# Altium schematic sheet FlybackV1.0.SchDoc: 150W-24V-CCM-DCM-FLyback-Converter
size A4; DrawnBy: Arturo B.; Revision: V1.0; SheetNumber: 1; SheetTotal: 1; Project: FlybackV1.0
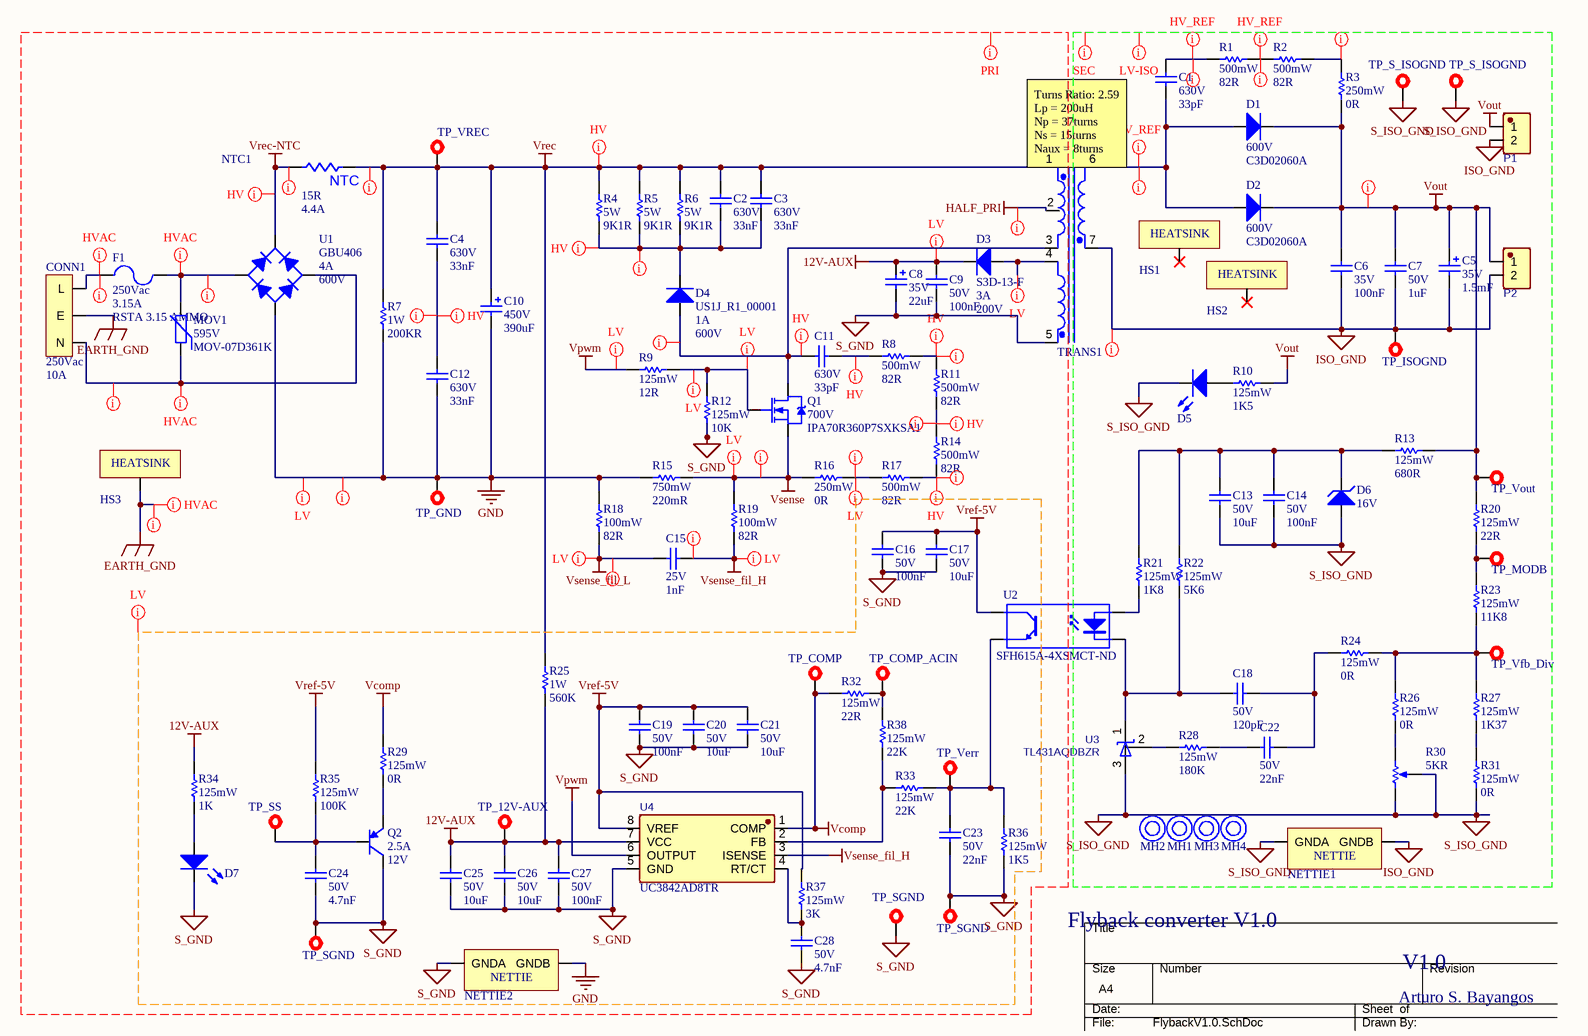
[diagram p0: FlybackV1.0.SchDoc]

## Parts
(Parts that share a designator on the sheet are numbered #1, #2 ... from top to bottom, then left to right.)
C1  value 33pF  Voltage: 630V  [CAP_1206]  (hidden comment: CAP_33P_1206_630V_COG_5%)
C2  value 33nF  Voltage: 630V  [CAP_1206]  (hidden comment: CAP_33N_1206_630V_X7R_10%)
C3  value 33nF  Voltage: 630V  [CAP_1206]  (hidden comment: CAP_33N_1206_630V_X7R_10%)
C4  value 33nF  Voltage: 630V  [CAP_1206]  (hidden comment: CAP_33N_1206_630V_X7R_10%)
C5  value 1.5mF  Voltage_Max: 35V  [CAP_TH_Radial_P5mm_D12.5mm_H16mm]  (hidden comment: CAP_1M5_35V_20%_TH-Radial-P5mm-D12.5mm-H16mm)
C6  value 100nF  Voltage: 35V  [CAP_1206]  (hidden comment: CAP_100N_1206_35V_X7R_10%)
C7  value 1uF  Voltage: 50V  [CAP_0805]  (hidden comment: CAP_1U_0805_50V_X7R_10%)
C8  value 22uF  Voltage_Max: 35V  [CAP_SMD_D5mm-L5.3mm]  (hidden comment: CAP_22U_35V_20%_SMD-D5mm-L5.3mm)
C9  value 100nF  Voltage: 50V  [CAP_0805]  (hidden comment: CAP_100N_0805_50V_X7R_10%)
C10  value 390uF  Voltage_Max: 450V  [CAP_TH_Radial_P10mm_D35mm_H27.5mm]  (hidden comment: CAP_390U_450V_20%_TH-Radial-P10mm-D35mm-H27.5mm)
C11  value 33pF  Voltage: 630V  [CAP_1206]  (hidden comment: CAP_33P_1206_630V_COG_5%)
C12  value 33nF  Voltage: 630V  [CAP_1206]  (hidden comment: CAP_33N_1206_630V_X7R_10%)
C13  value 10uF  Voltage: 50V  [CAP_0805]  (hidden comment: CAP_10U_0805_50V_X5R_10%)
C14  value 100nF  Voltage: 50V  [CAP_0805]  (hidden comment: CAP_100N_0805_50V_X7R_10%)
C15  value 1nF  Voltage: 25V  [CAP_0805]  (hidden comment: CAP_1N_0805_25V_X7R_10%)
C16  value 100nF  Voltage: 50V  [CAP_0805]  (hidden comment: CAP_100N_0805_50V_X7R_10%)
C17  value 10uF  Voltage: 50V  [CAP_0805]  (hidden comment: CAP_10U_0805_50V_X5R_10%)
C18  value 120pF  Voltage: 50V  [CAP_0805]  (hidden comment: CAP_120P_0805_50V_X7R_10%)
C19  value 100nF  Voltage: 50V  [CAP_0805]  (hidden comment: CAP_100N_0805_50V_X7R_10%)
C20  value 10uF  Voltage: 50V  [CAP_0805]  (hidden comment: CAP_10U_0805_50V_X5R_10%)
C21  value 10uF  Voltage: 50V  [CAP_0805]  (hidden comment: CAP_10U_0805_50V_X5R_10%)
C22  value 22nF  Voltage: 50V  [CAP_0805]  (hidden comment: CAP_22N_0805_50V_X7R_10%)
C23  value 22nF  Voltage: 50V  [CAP_0805]  (hidden comment: CAP_22N_0805_50V_X7R_10%)
C24  value 4.7nF  Voltage: 50V  [CAP_0805]  (hidden comment: CAP_4N7_0805_50V_X7R_10%)
C25  value 10uF  Voltage: 50V  [CAP_0805]  (hidden comment: CAP_10U_0805_50V_X5R_10%)
C26  value 10uF  Voltage: 50V  [CAP_0805]  (hidden comment: CAP_10U_0805_50V_X5R_10%)
C27  value 100nF  Voltage: 50V  [CAP_0805]  (hidden comment: CAP_100N_0805_50V_X7R_10%)
C28  value 4.7nF  Voltage: 50V  [CAP_0805]  (hidden comment: CAP_4N7_0805_50V_X7R_10%)
CONN1  Voltage: 250Vac  Current: 10A  [AC_CONNECTOR_703W-00/54]  (hidden comment: AC_CONNECTOR)
D1  Voltage: 600V  Part_Number: C3D02060A  [T0-220-2]  (hidden comment: DIODE_600V_3KPW8_SIC_T0220)
D2  Voltage: 600V  Part_Number: C3D02060A  [T0-220-2]  (hidden comment: DIODE_600V_3KPW8_SIC_T0220)
D3  Part_Number: S3D-13-F  Current: 3A  Voltage: 200V  [DIODE_SMC]  (hidden comment: DIODE_200V_3A_20ns_SMC)
D4  Part_Number: US1J_R1_00001  Current: 1A  Voltage: 600V  [SMA_L4.4-W2.6-LS5.0-RD]  (hidden comment: DIODE_600V_1A_100ns_SMA)
D5  LED_GREEN_0805_25mA  [LED_0805]  (value not drawn)
D6  Voltage: 16V  [ZENER_SOD-323]  (hidden comment: ZENER_16V_SOD323_200mW)
D7  LED_GREEN_0805_25mA  [LED_0805]  (value not drawn)
F1  Voltage AC: 250Vac  Rated Current: 3.15A  Part_Number: RSTA 3.15 AMMO  [FUSE_P5.08mm_W4mm_L8.35mm_H7.8mm]  (hidden comment: FUSE_3.15A_250VAC_64VDC_SlowBlow_BoardMount)
HS1  HEATSINK_TO-220_14.7KPW  [HEATSINK_TO-220_HSS-B20-NPS-02]  (value not drawn)
HS2  HEATSINK_TO-220_14.7KPW  [HEATSINK_TO-220_HSS-B20-NPS-02]  (value not drawn)
HS3  HEATSINK_TO-220_14.7KPW  [HEATSINK_TO-220_HSS-B20-NPS-02]  (value not drawn)
MH1  MOUNTINGHOLE_HDM3_OD3mm  [STANDOFF_HDM3_OD5mm]  (value not drawn)
MH2  MOUNTINGHOLE_HDM3_OD3mm  [STANDOFF_HDM3_OD5mm]  (value not drawn)
MH3  MOUNTINGHOLE_HDM3_OD3mm  [STANDOFF_HDM3_OD5mm]  (value not drawn)
MH4  MOUNTINGHOLE_HDM3_OD3mm  [STANDOFF_HDM3_OD5mm]  (value not drawn)
MOV1  Vclamp @ 10A: 595V  Part_Number: MOV-07D361K  [MOV_P5mm_D9mm_W4.4mm]  (hidden comment: MOV_VC595_VAC230)
NETTIE1  NETTIE  [NETTIE]  (value not drawn)
NETTIE2  NETTIE  [NETTIE]  (value not drawn)
NTC1  R25: 15R  Irated: 4.4A  [NTC_P7.5mm_D16mm]  (hidden comment: NTC_15R_4.4A_D16mm)
P1  SCREWTERMINAL_P5.08mm  [SCREW_TERMINAL_P5.08mm]  (value not drawn)
P2  SCREWTERMINAL_P5.08mm  [SCREW_TERMINAL_P5.08mm]  (value not drawn)
Q1  Vds_Max: 700V  Part_Number: IPA70R360P7SXKSA1  [T0-220-3]  (hidden comment: NMOS_700V_IPA70R360P7SXKSA1)
Q2  Current: 2.5A  VCE: 12V  [SOT-23-3]  (hidden comment: PNP_12V_2.5A_SOT-23-3)
R1  value 82R  Power: 500mW  [RES_1210]  (hidden comment: RES_82R_1210_0.5W_1%)
R2  value 82R  Power: 500mW  [RES_1210]  (hidden comment: RES_82R_1210_0.5W_1%)
R3  value 0R  Power: 250mW  [RES_1210]  (hidden comment: RES_0R_1206_0.25W_1%)
R4  value 9K1R  Power: 5W  [RES_TH_AXIAL_L17.5mm_D6.5mm_Vertical]  (hidden comment: RES_9K1_TH_5W_5%_AXIAL)
R5  value 9K1R  Power: 5W  [RES_TH_AXIAL_L17.5mm_D6.5mm_Vertical]  (hidden comment: RES_9K1_TH_5W_5%_AXIAL)
R6  value 9K1R  Power: 5W  [RES_TH_AXIAL_L17.5mm_D6.5mm_Vertical]  (hidden comment: RES_9K1_TH_5W_5%_AXIAL)
R7  value 200KR  Power: 1W  [RES_TH_AXIAL_L18mm_D6.8mm]  (hidden comment: RES_200K_TH_1W_5%_AXIAL)
R8  value 82R  Power: 500mW  [RES_1210]  (hidden comment: RES_82R_1210_0.5W_1%)
R9  value 12R  Power: 125mW  [RES_0805]  (hidden comment: RES_12R_0805_0.125W_5%)
R10  value 1K5  Power: 125mW  [RES_0805]  (hidden comment: RES_1K5_0805_0.125W_1%)
R11  value 82R  Power: 500mW  [RES_1210]  (hidden comment: RES_82R_1210_0.5W_1%)
R12  value 10K  Power: 125mW  [RES_0805]  (hidden comment: RES_10K_0805_0.125W_1%)
R13  value 680R  Power: 125mW  [RES_0805]  (hidden comment: RES_680R_0805_0.125W_1%)
R14  value 82R  Power: 500mW  [RES_1210]  (hidden comment: RES_82R_1210_0.5W_1%)
R15  value 220mR  Power: 750mW  [RES_1210]  (hidden comment: RES_220mR_1210_0.75W_1%)
R16  value 0R  Power: 250mW  [RES_1210]  (hidden comment: RES_0R_1206_0.25W_1%)
R17  value 82R  Power: 500mW  [RES_1210]  (hidden comment: RES_82R_1210_0.5W_1%)
R18  value 82R  Power: 100mW  [RES_0603]  (hidden comment: RES_82R_0603_0.1W_1%)
R19  value 82R  Power: 100mW  [RES_0603]  (hidden comment: RES_82R_0603_0.1W_1%)
R20  value 22R  Power: 125mW  [RES_0805]  (hidden comment: RES_22R_0805_0.125W_1%)
R21  value 1K8  Power: 125mW  [RES_0805]  (hidden comment: RES_1K8_0805_0.125W_1%)
R22  value 5K6  Power: 125mW  [RES_0805]  (hidden comment: RES_5K6_0805_0.125W_1%)
R23  value 11K8  Power: 125mW  [RES_0805]  (hidden comment: RES_11K8_0805_0.125W_1%)
R24  value 0R  Power: 125mW  [RES_0805]  (hidden comment: RES_0R_0805_0.125W_1%)
R25  value 560K  Power: 1W  [RES_2512]  (hidden comment: RES_560K_2512_1W_1%)
R26  value 0R  Power: 125mW  [RES_0805]  (hidden comment: RES_0R_0805_0.125W_1%)
R27  value 1K37  Power: 125mW  [RES_0805]  (hidden comment: RES_1K37_0805_0.125W_1%)
R28  value 180K  Power: 125mW  [RES_0805]  (hidden comment: RES_180K_0805_0.125W_1%)
R29  value 0R  Power: 125mW  [RES_0805]  (hidden comment: RES_0R_0805_0.125W_1%)
R30  value 5KR  [RES_SMD_POT_3PINS]  (hidden comment: RES_5K_SMD-POT_0.15mW_25%)
R31  value 0R  Power: 125mW  [RES_0805]  (hidden comment: RES_0R_0805_0.125W_1%)
R32  value 22R  Power: 125mW  [RES_0805]  (hidden comment: RES_22R_0805_0.125W_1%)
R33  value 22K  Power: 125mW  [RES_0805]  (hidden comment: RES_22K_0805_0.125W_1%)
R34  value 1K  Power: 125mW  [RES_0805]  (hidden comment: RES_1K_0805_0.125W_1%)
R35  value 100K  Power: 125mW  [RES_0805]  (hidden comment: RES_100K_0805_0.125W_1%)
R36  value 1K5  Power: 125mW  [RES_0805]  (hidden comment: RES_1K5_0805_0.125W_1%)
R37  value 3K  Power: 125mW  [RES_0805]  (hidden comment: RES_3K_0805_0.125W_1%)
R38  value 22K  Power: 125mW  [RES_0805]  (hidden comment: RES_22K_0805_0.125W_1%)
TP_12V-AUX  TESTPOINT_BD2.5mm_MHD1mm  [Test_Point_BD2.5mm_MHD_1mm]  (value not drawn)
TP_COMP  TESTPOINT_BD2.5mm_MHD1mm  [Test_Point_BD2.5mm_MHD_1mm]  (value not drawn)
TP_COMP_ACIN  TESTPOINT_BD2.5mm_MHD1mm  [Test_Point_BD2.5mm_MHD_1mm]  (value not drawn)
TP_GND  TESTPOINT_BD2.5mm_MHD1mm  [Test_Point_BD2.5mm_MHD_1mm]  (value not drawn)
TP_ISOGND  TESTPOINT_BD2.5mm_MHD1mm  [Test_Point_BD2.5mm_MHD_1mm]  (value not drawn)
TP_MODB  TESTPOINT_BD2.5mm_MHD1mm  [Test_Point_BD2.5mm_MHD_1mm]  (value not drawn)
TP_S_ISOGND#1  TESTPOINT_BD2.5mm_MHD1mm  [Test_Point_BD2.5mm_MHD_1mm]  (value not drawn)
TP_S_ISOGND#2  TESTPOINT_BD2.5mm_MHD1mm  [Test_Point_BD2.5mm_MHD_1mm]  (value not drawn)
TP_SGND#1  TESTPOINT_BD2.5mm_MHD1mm  [Test_Point_BD2.5mm_MHD_1mm]  (value not drawn)
TP_SGND#2  TESTPOINT_BD2.5mm_MHD1mm  [Test_Point_BD2.5mm_MHD_1mm]  (value not drawn)
TP_SGND#3  TESTPOINT_BD2.5mm_MHD1mm  [Test_Point_BD2.5mm_MHD_1mm]  (value not drawn)
TP_SS  TESTPOINT_BD2.5mm_MHD1mm  [Test_Point_BD2.5mm_MHD_1mm]  (value not drawn)
TP_Verr  TESTPOINT_BD2.5mm_MHD1mm  [Test_Point_BD2.5mm_MHD_1mm]  (value not drawn)
TP_Vfb_Div  TESTPOINT_BD2.5mm_MHD1mm  [Test_Point_BD2.5mm_MHD_1mm]  (value not drawn)
TP_Vout  TESTPOINT_BD2.5mm_MHD1mm  [Test_Point_BD2.5mm_MHD_1mm]  (value not drawn)
TP_VREC  TESTPOINT_BD2.5mm_MHD1mm  [Test_Point_BD2.5mm_MHD_1mm]  (value not drawn)
TRANS1  Transformer_ETD34_SPLIT  [ETD34_Horizontal_EXTRAPADS]  (value not drawn)
U1  Part_Number: GBU406  I_MAX: 4A  V_Max: 600V  [4_SIP]  (hidden comment: DiodeBrige_600V_4A_TH-4-SIP-5.3mm)
U2  Supplier Part Number 1: SFH615A-4XSMCT-ND  [4-SMD]  (hidden comment: OPTOCOUPLER_SFH615A-4XSMT/R)
U3  TL431AQDBZR  [SOT-23]
U4  UC3842AD8TR  [SOIC-8]

## Nets
12V-AUX: C8.1 C9.2 C25.2 C26.2 C27.2 D3.1(K) R25.2 R34.2 TP_12V-AUX.1(TEST_POINT) U4.7(VCC)
EARTH_GND: CONN1.E HS3.HSMH
GND: C10.2 C12.1 NETTIE2.GNDB R7.1 R15.2 R18.2 TP_GND.1(TEST_POINT) U1.3(AC)
HALF_PRI: TRANS1.2(Pri_2)
ISO_GND: C5.2 C6.1 C7.1 NETTIE1.GNDB P1.2 P2.2 TP_ISOGND.1(TEST_POINT) TRANS1.7(Sec_6)
S_GND: C8.2 C9.1 C16.1 C17.1 C19.1 C20.1 C21.1 C23.1 C24.2 C25.1 C26.1 C27.1 C28.2 D7.2(K) NETTIE2.GNDA Q2.3(C) R12.1 R36.1 TP_SGND#1.1(TEST_POINT) TP_SGND#2.1(TEST_POINT) TP_SGND#3.1(TEST_POINT) TRANS1.5(Pri_4) U4.5(GND)
S_ISO_GND: C13.1 C14.1 D5.2(K) D6.2(A) NETTIE1.GNDA R30.1(TOP) R30.2(TAP) R31.1 TP_S_ISOGND#1.1(TEST_POINT) TP_S_ISOGND#2.1(TEST_POINT) U3.3(A)
Vcomp: R29.2 R32.1 TP_COMP.1(TEST_POINT) U4.1(COMP)
Vout: C5.1 C6.2 C7.2 D1.1(K) D2.1(K) P1.1 P2.1 R3.1 R10.2 R13.2 R20.2 TP_Vout.1(TEST_POINT)
Vpwm: R9.2 U4.6(OUTPUT)
Vrec: C2.2 C3.2 C4.2 C10.1 NTC1.1 R4.2 R5.2 R6.2 R7.2 R25.1 TP_VREC.1(TEST_POINT) TRANS1.1(Pri_1)
Vrec-NTC: NTC1.2 U1.2(AC)
Vref-5V: C16.2 C17.2 C19.2 C20.2 C21.2 R35.2 R37.2 U2.4(C) U4.8(VREF)
Vsense: Q1.3(S) R15.1 R16.2 R19.2
Vsense_fil_H: C15.1 R19.1 U4.3(ISENSE)
Vsense_fil_L: C15.2 R18.1
NetC1_1: C1.1 D1.2(A) D2.2(A) TRANS1.6(Sec_5)
NetC1_2: C1.2 R1.1
NetC2_1: C2.1 C3.1 D4.1(K) R4.1 R5.1 R6.1
NetC4_1: C4.1 C12.2
NetC11_1: C11.1 D4.2(A) Q1.2(D) TRANS1.3(Pri_2)
NetC11_2: C11.2 R8.2
NetC13_2: C13.2 C14.2 D6.1(K) R13.1 R21.2 R22.2
NetC18_1: C18.1 C22.2 R24.2
NetC18_2: C18.2 R22.1 U2.2(K) U3.1(C)
NetC22_1: C22.1 R28.2
NetC23_2: C23.2 R33.2 R36.2 TP_Verr.1(TEST_POINT) U2.3(E)
NetC24_1: C24.1 Q2.1(B) R35.1 TP_SS.1(TEST_POINT)
NetC28_1: C28.1 R37.1 U4.4(RT/CT)
NetCONN1_L: CONN1.L F1.2
NetCONN1_N: CONN1.N MOV1.1 U1.4(-)
NetD3_2: D3.2(A) TRANS1.4(Pri_3)
NetD5_1: D5.1(A) R10.1
NetD7_1: D7.1(A) R34.1
NetF1_1: F1.1 MOV1.2 U1.1(+)
NetQ1_1: Q1.1(G) R9.1 R12.2
NetQ2_2: Q2.2(E) R29.1
NetR1_2: R1.2 R2.2
NetR2_1: R2.1 R3.2
NetR8_1: R8.1 R11.1
NetR11_2: R11.2 R14.1
NetR14_2: R14.2 R17.1
NetR16_1: R16.1 R17.2
NetR20_1: R20.1 R23.2 TP_MODB.1(TEST_POINT)
NetR21_1: R21.1 U2.1(A)
NetR23_1: R23.1 R24.1 R26.2 R27.2 TP_Vfb_Div.1(TEST_POINT)
NetR26_1: R26.1 R30.3(BOT)
NetR27_1: R27.1 R31.2
NetR28_1: R28.1 U3.2(R)
NetR32_2: R32.2 R38.2 TP_COMP_ACIN.1(TEST_POINT)
NetR33_1: R33.1 R38.1 U4.2(FB)

Not connected (* = marked no-connect by the designer): HS1 HSMH*; HS2 HSMH*

## Layout directives
net class LV: 12V-AUX, GND, NetD3_2, NetQ1_1, NetR16_1, S_GND, Vcomp, Vpwm, Vref-5V, Vsense, Vsense_fil_H, Vsense_fil_L
net class HV: NetC2_1, NetC4_1, NetC11_1, NetC11_2, NetR8_1, NetR11_2, NetR14_2, Vrec, Vrec-NTC
net class HVAC: EARTH_GND, NetCONN1_L, NetCONN1_N, NetF1_1
net class LV-ISO: ISO_GND, S_ISO_GND, Vout
net class PRI: 12V-AUX, EARTH_GND, GND, HALF_PRI, S_GND, Vcomp, Vpwm, Vrec, Vrec-NTC, Vref-5V, Vsense, Vsense_fil_H, Vsense_fil_L
net class SEC: ISO_GND, S_ISO_GND, Vout
net class HV_REF: NetC1_1, NetC1_2, NetR1_2
net class POWER_TRACE: EARTH_GND, GND, HALF_PRI, ISO_GND, NetC1_1, NetC1_2, NetC2_1, NetC4_1, NetC11_1, NetCONN1_L, NetCONN1_N, NetF1_1, NetR1_2, NetR2_1, NetR8_1, NetR11_2, NetR14_2, NetR16_1, Vout, Vrec, Vrec-NTC, Vsense, Vsense_fil_H, Vsense_fil_L

## Notes on the sheet
- (near TRANS1) Turns Ratio: 2.59
  Lp = 200uH
  Np = 37turns
  Ns = 15turns
  Naux = 8turns
- NTC cooldown time is 80sec.
  the 5*RC is designed to be 5*times the cooldown time.
  At max input voltage 230*1.1*sqrt(2), and after 80sec, the Vcap is around 130V.
  Ploss at max vcap is around 0.7W.
- (near R9) Input capacitor are choosen to minimize their rms current, while at the same time minimizng the increase in Iswitch rms and inductor peak current due to duty cycle increasing as input voltage become lower with lower input capacitance.
  Input capacitor max rms is 1.33A
- Can use: C159209
  1% 220mR
  for current sense
  1V @ 4.5A.
- ploss of the MOSFET at full load and min Vin is roughly 3W. Need to use heatsink.
  Use 577002B00000G, to achieve 100degC temp on the mosfet, assuming ambient is 40degC.
- Flyback converter V1.0
- V1.0
- Arturo S. Bayangos
- THIS DOCUMENT AND THE DATA DISCLOSED HEREIN OR
- HEREWITH IS THE PROPERTY OF ALTIUM LIMITED AND MAY
- DWG NO:
- REVISION
- REV:
- DESCRIPTION
- DATE
- APPROVED
- BE FREELY DISTRIBUTED IN WHOLE. NO RIGHTS ARE
- RESERVED OR EXPRESS OR IMPLIED WARANTEE GIVEN.
- ENG:
- APPROVALS
- PROJECT
- DSN:
- CHK:
- REFERENCE DOCUMENTS
- PROJECT REVISION:
- TITLE
- DOCUMENT REVISION:
- DESIGN ITEM:
- BOM:
- FAB DWG:
- PCB DWG:
- ASSY DWG:
- SCALE:
- A3
- SIZE
- CAGE CODE
- FILE NAME
- DWG NO.
- SHEET
- OF
- REV
- (in symbol HEATSINK_TO-220_14.7KPW) HEATSINK
- (in symbol NTC_15R_4.4A_D16mm) NTC

## Library data of the parts
C1 C11 = CAP_33P_1206_630V_COG_5%: 630V 33pF C0G ±5% 1206  Multilayer Ceramic Capacitors MLCC - SMD/SMT ROHS; Part_Number: GRM31A5C2J330JW01D; Dialectric: COG; JLC#: C415521; Package: 1206
C2-C4 C12 = CAP_33N_1206_630V_X7R_10%: Ceramic cap 33nF, 630V , X7R , 1206 , 10%; Part_Number: NM1206B333K631CEGN; JLC#: C710477; Dialectric: X7R; Package: 1206
C5 = CAP_1M5_35V_20%_TH-Radial-P5mm-D12.5mm-H16mm: 1500 µF 35 V Aluminum Electrolytic Capacitors Radial, Can 6000 Hrs @ 105°C; Part_Number: 35ZLQ1500MEFC12.5X30; Irms_Max @ 120Hz: 2.208A; Irms_Max @ 100kHz: 3.68A; ESR: 12mR; JLC#: ?
C6 = CAP_100N_1206_35V_X7R_10%: 50V 100nF X7R ±10% 1206  Multilayer Ceramic Capacitors MLCC - SMD/SMT ROHS; Part_Number: CL31B104KBCNNNC; JLC#: C24497; Dialectric: X7R; Package: 1206
C7 = CAP_1U_0805_50V_X7R_10%: 50V 1uF X7R ±10% 0805  Multilayer Ceramic Capacitors MLCC - SMD/SMT ROHS; Part_Number: CL21B105KBFNNNE; JLC#: C28323; Dialectric: X7R; Package: 0805
C8 = CAP_22U_35V_20%_SMD-D5mm-L5.3mm: -45℃~+105℃ 1000hrs@105℃ 22uF 5.3mm 35V 5mm ±20% SMD,D5xL5.3mm  Aluminum Electrolytic Capacitors - SMD ROHS; Part_Number: VES220M1VTR-0505; JLC#: C249702; Irms_Max: ?
C9 C14 C16 C19 C27 = CAP_100N_0805_50V_X7R_10%: 50V 100nF X7R ±10% 0805  Multilayer Ceramic Capacitors MLCC - SMD/SMT ROHS; Part_Number: CC0805KRX7R9BB104; JLC#: C49678; Dialectric: X7R; Package: 0805
C10 = CAP_390U_450V_20%_TH-Radial-P10mm-D35mm-H27.5mm: Polarized Capacitor (Radial) 390UF, 450V, 20%, 2.05A @ 120Hz TH Radial 10m Pitch , 35mm Diameter , 27.5mm Heigth; Part_Number: ESMR401VSN391MA25S; JLC#: ?; Irms_Max: 2.05 A @ 120Hz
C13 C17 C20 C21 C25 C26 = CAP_10U_0805_50V_X5R_10%: 50V 10uF X5R ±10% 0805  Multilayer Ceramic Capacitors MLCC - SMD/SMT ROHS; Part_Number: GRM21BR61H106KE43L; JLC#: C440198; Dialectric: X5R; Package: 0805
C15 = CAP_1N_0805_25V_X7R_10%: 25V 1nF X7R ±10% 0805  Multilayer Ceramic Capacitors MLCC - SMD/SMT ROHS; Part_Number: CC0805KRX7R8BB102; JLC#: C519910; Dialectric: X7R; Package: 0805
C18 = CAP_120P_0805_50V_X7R_10%: 50V 120pF X7R ±10% 0805  Multilayer Ceramic Capacitors MLCC - SMD/SMT ROHS; Part_Number: TCC0805X7R121K500BT; JLC#: C376930; Dialectric: X7R; Package: 0805
C22 C23 = CAP_22N_0805_50V_X7R_10%: 50V 22nF X7R ±10% 0805  Multilayer Ceramic Capacitors MLCC - SMD/SMT ROHS; Part_Number: CL21B223KBANNNC; JLC#: C1729; Dialectric: X7R; Package: 0805
C24 C28 = CAP_4N7_0805_50V_X7R_10%: 50V 4.7nF X7R ±10% 0805  Multilayer Ceramic Capacitors MLCC - SMD/SMT ROHS; Part_Number: 0805B472K500NT; JLC#: C1744; Dialectric: X7R; Package: 0805
CONN1 = AC_CONNECTOR: Power Entry Connector Receptacle, Male Blades IEC 320-C14 Panel Mount, Flange; Through Hole, Right Angle; Part_Number: 703W-00/54
D1 D2 = DIODE_600V_3KPW8_SIC_T0220: Diode Silicon Carbide Schottky 600 V 5A Through Hole TO-220-2; Trr: 0ns; Rjlead: 30K/W; Tjmax: 150degC; Current: 4A @ Tc = 135degC; Rjc: 3.8K/W; JLC#: ?; ComponentLink1Description: New link; ComponentLink1URL: *
D3 = DIODE_200V_3A_20ns_SMC: 3A 10uA@200V 200V 1.15V@3A SMC(DO-214AB)  Diodes - General Purpose ROHS; Trr: 20ns; Rjlead: 12K/W; Tjmax: 150degC; JLC#: C156341; ComponentLink1Description: New link; ComponentLink1URL: *
D4 = DIODE_600V_1A_100ns_SMA: 1.7V@1A 1uA@600V 100ns Single 1A -55℃~+150℃@(Tj) 600V SMA  Diodes - Fast Recovery Rectifiers ROHS; Rjlead: 30K/W; Tjmax: 150degC; JLC#: C391757; ComponentLink1Description: New link; ComponentLink1URL: *; Trr: 100ns
D5 D7 = LED_GREEN_0805_25mA: Green/Yellow-Green 0805  Light Emitting Diodes (LED) ROHS; Part_Number: 17-215/GPC-AL1M2L/3T; Vforward: 2.3V; Imax: 25mA; JLC#: C264433; Package: 0805
D6 = ZENER_16V_SOD323_200mW: 0.1uA@11.2V 40Ω 15.3V~17.1V 200mW 16V SOD-323  Zener Diodes ROHS; Part_Number: BZT52C16SQ-7-F; JLC#: C691210; Package: SOD-323; Power: 200mW
F1 = FUSE_3.15A_250VAC_64VDC_SlowBlow_BoardMount: 3.15 A 250 V AC 63 V DC Fuse Board Mount (Cartridge Style Excluded) Through Hole Radial, Box; Voltage DC: 64Vdc; JLC#: *; Response_Time: Slow blow
HS1-HS3 = HEATSINK_TO-220_14.7KPW: Heat Sink TO-220 Aluminum 5.1W @ 75°C Board Level; Part_Number: HSS-B20-NPS-02; Thermal Resistance @ Natural: 14.71°C/W; Thermal Resistance @ Forced Air Flow: 4.20°C/W @ 200 LFM; Package_Cooled: TO-220
MOV1 = MOV_VC595_VAC230: 360 V 1.2 kA Varistor 1 Circuit Through Hole Disc 7mm; Response_Time: 25ns; Vcontinous: 230Vrms
NTC1 = NTC_15R_4.4A_D16mm: Inrush Current Limiter 15 Ohms ±20% 4.4 A 0.630" (16.00mm); Part_Number: B57238S0150M000; CT @ 230VAC: 700uF; Thermal cooling time constant (in air): 80s; JLC#: ?; Diameter: 16mm; Tolerance: 20%
P1 P2 = SCREWTERMINAL_P5.08mm: Copper 0.2~2 -40℃~+105℃ 15A 300V Green Tin 250℃ 5.08mm 1 26~14 2 P=5.08mm  Screw terminal ROHS; Part_Number: JL500-50802G01; JLC#: C709041; Pitch: 5.08mm; Voltage: 300V; Current: 15A
Q1 = NMOS_700V_IPA70R360P7SXKSA1: N-Channel Power MOSFET, 700Vds, T0-220-3; Rds(on)_Max: 0.36R; RthJC: 4.7K/W; Tj_Max: 150deg; ComponentLink1Description: Manufacturer Link; ComponentLink1URL: http://www.irf.com/; JLC#: ?
Q2 = PNP_12V_2.5A_SOT-23-3: 12V 625mW 2.5A PNP SOT-23-3  Bipolar Transistors - BJT ROHS; Part_Number: FMMT717TA; VEB: 7V; JLC#: C500779; Power: 625mW; Package: SOT-23-3
R1 R2 R8 R11 R14 R17 = RES_82R_1210_0.5W_1%: 500mW Thick Film Resistors 200V ±100ppm/℃ ±5% -55℃~+155℃ 82Ω 1210  Chip Resistor - Surface Mount ROHS; Part_Number: RC1210JR-0782RL; Voltage: 200V; JLC#: C728413; Package: 1210
R3 R16 = RES_0R_1206_0.25W_1%: 250mW Thick Film Resistors 200V ±800ppm/℃ ±1% -55℃~+155℃ 0Ω 1206  Chip Resistor - Surface Mount ROHS; Part_Number: 1206W4F0000T5E; Voltage: 200V; JLC#: C17888; Package: 1206
R4-R6 = RES_9K1_TH_5W_5%_AXIAL: 9.1 kOhms ±5% 5W Through Hole Resistor Axial Flame Proof, Pulse Withstanding, Safety Metal Oxide Film; Part_Number: ROX5SSJ9K1; Voltage: 750V; JLC#: ?
R7 = RES_200K_TH_1W_5%_AXIAL: 200 kOhms ±5% 1W Through Hole Resistor Axial High Voltage, Pulse Withstanding Metal Film; Part_Number: VR68000002003JAC00; Voltage: 750V; JLC#: ?
R9 = RES_12R_0805_0.125W_5%: 125mW Thick Film Resistors 150V ±1% ±200ppm/℃ -55℃~+155℃ 12Ω 0805  Chip Resistor - Surface Mount ROHS; Part_Number: 0805W8F120JT5E; Voltage: 150V; JLC#: C17445; Package: 0805
R10 R36 = RES_1K5_0805_0.125W_1%: 125mW Thick Film Resistors 150V ±100ppm/℃ ±1% -55℃~+155℃ 1.5kΩ 0805  Chip Resistor - Surface Mount ROHS; Part_Number: 0805W8F1501T5E; Voltage: 150V; JLC#: C4310; Package: 0805
R12 = RES_10K_0805_0.125W_1%: 125mW Thick Film Resistors 150V ±100ppm/℃ ±1% -55℃~+155℃ 10kΩ 0805  Chip Resistor - Surface Mount ROHS; Part_Number: 0805W8F1002T5E; Voltage: 150V; JLC#: C17414; Package: 0805
R13 = RES_680R_0805_0.125W_1%: 125mW Thick Film Resistors 150V ±100ppm/℃ ±1% -55℃~+155℃ 680Ω 0805  Chip Resistor - Surface Mount ROHS; Part_Number: 0805W8F6800T5E; Voltage: 150V; JLC#: C17798; Package: 0805
R15 = RES_220mR_1210_0.75W_1%: 1W Thick Film Resistors 800V ±1% -55℃~+155℃ 560kΩ 2512  Chip Resistor - Surface Mount ROHS; Part_Number: RTT20R220FTE; Voltage: 200V; JLC#: C159209; Package: 1210
R18 R19 = RES_82R_0603_0.1W_1%: 100mW Thick Film Resistors 75V ±100ppm/℃ ±1% -55℃~+155℃ 82Ω 0603  Chip Resistor - Surface Mount ROHS; Part_Number: 0603WAF820JT5E; Voltage: 75V; JLC#: C23255; Package: 0603
R20 R32 = RES_22R_0805_0.125W_1%: 125mW Thick Film Resistors 150V ±100ppm/℃ ±1% -55℃~+155℃ 22Ω 0805  Chip Resistor - Surface Mount ROHS; Part_Number: 0805W8F220JT5E; Voltage: 150V; JLC#: C17561; Package: 0805
R21 = RES_1K8_0805_0.125W_1%: 125mW Thick Film Resistors 150V ±100ppm/℃ ±1% -55℃~+155℃ 1.8kΩ 0805  Chip Resistor - Surface Mount ROHS; Part_Number: 0805W8F1801T5E; Voltage: 150V; JLC#: C17398; Package: 0805
R22 = RES_5K6_0805_0.125W_1%: 125mW Thick Film Resistors 150V ±100ppm/℃ ±1% -55℃~+155℃ 5.6kΩ 0805  Chip Resistor - Surface Mount ROHS; Part_Number: 0805W8F5601T5E; Voltage: 150V; JLC#: C4382; Package: 0805
R23 = RES_11K8_0805_0.125W_1%: 125mW Thick Film Resistors 150V ±100ppm/℃ ±1% -55℃~+155℃ 11.8kΩ 0805  Chip Resistor - Surface Mount ROHS; Part_Number: 0805W8F1182T5E; Voltage: 150V; JLC#: C17420; Package: 0805
R24 R26 R29 R31 = RES_0R_0805_0.125W_1%: 125mW Thick Film Resistors 150V ±800ppm/℃ ±1% -55℃~+155℃ 0Ω 0805  Chip Resistor - Surface Mount ROHS; Part_Number: 0805W8F0000T5E; Voltage: 150V; JLC#: C17477; Package: 0805
R25 = RES_560K_2512_1W_1%: 1W ±100ppm/℃ ±5% 560kΩ 2512  Chip Resistor - Surface Mount ROHS; Part_Number: RC-12K564JT; Voltage: 800V; JLC#: C454037; Package: 2512
R27 = RES_1K37_0805_0.125W_1%: 125mW Thick Film Resistors 150V ±100ppm/℃ ±1% -55℃~+155℃ 1.37kΩ 0805  Chip Resistor - Surface Mount ROHS; Part_Number: CR0805F1K37P05Z; Voltage: 150V; JLC#: C245260; Package: 0805
R28 = RES_180K_0805_0.125W_1%: 125mW Thick Film Resistors 150V ±100ppm/℃ ±1% -55℃~+155℃ 180kΩ 0805  Chip Resistor - Surface Mount ROHS; Part_Number: 0805W8F1803T5E; Voltage: 150V; JLC#: C17501; Package: 0805
R30 = RES_5K_SMD-POT_0.15mW_25%: ±25% ±250ppm/℃ 5kΩ SMD  Variable Resistors/Potentiometers ROHS; Part_Number: VG039NCHXTB502; JLC#: C128557; Package: SMD
R33 R38 = RES_22K_0805_0.125W_1%: 125mW Thick Film Resistors 150V ±100ppm/℃ ±1% -55℃~+155℃ 22kΩ 0805  Chip Resistor - Surface Mount ROHS; Part_Number: 0805W8F2202T5E; Voltage: 150V; JLC#: C17560; Package: 0805
R34 = RES_1K_0805_0.125W_1%: 125mW Thick Film Resistors 150V ±100ppm/℃ ±1% -55℃~+155℃ 1kΩ 0805  Chip Resistor - Surface Mount ROHS; Part_Number: 0805W8F1001T5E; Voltage: 150V; JLC#: C17513; Package: 0805
R35 = RES_100K_0805_0.125W_1%: 125mW Thick Film Resistors 150V ±100ppm/℃ ±1% -55℃~+155℃ 100kΩ 0805  Chip Resistor - Surface Mount ROHS; Part_Number: 0805W8F1003T5E; Voltage: 150V; JLC#: C149504; Package: 0805
R37 = RES_3K_0805_0.125W_1%: 125mW Thick Film Resistors 150V ±100ppm/℃ ±1% -55℃~+155℃ 3kΩ 0805  Chip Resistor - Surface Mount ROHS; Part_Number: 0805W8F3001T5E; Voltage: 150V; JLC#: C17661; Package: 0805
TP_12V-AUX TP_COMP TP_COMP_ACIN TP_GND TP_ISOGND TP_MODB TP_S_ISOGND#1 TP_S_ISOGND#2 TP_SGND#1-TP_SGND#3 TP_SS TP_Verr TP_Vfb_Div TP_Vout TP_VREC = TESTPOINT_BD2.5mm_MHD1mm: Black PC Test Point, Miniature Phosphor Bronze Silver Plating Through Hole Mounting Type; Part_Number: 5001; Mounting hole Diameter: 1mm; JLC#: ?; Base Diameter: 1mm
TRANS1 = Transformer_ETD34_SPLIT: Flyback converter transformer ETD34, 2 output winding, 1 input winding.
U1 = DiodeBrige_600V_4A_TH-4-SIP-5.3mm: Full Wave Diode Bridge, 600V, 4A.; Package: 4-SIP (5.3mm picth); JLC#: ?
U2 = OPTOCOUPLER_SFH615A-4XSMT/R: Optocoupler Dc-in 1-CH Transistor Dc-out 4-PIN PDIP SMD T/r; Manufacturer: Isocom; Number of Channels: 1; Max Output Voltage: 70V; Output Current per Channel: 50mA; Forward Voltage: 1.65V; Collector Emitter Voltage (VCEO): 400mV; Supplier 1: Digi-Key; Manufacturer Part Number: SFH615A-4XSMT/R; RoHS: No; Category: Optocouplers; Stock 1: 1084; Mount: Surface Mount; Case/Package: SMD/SMT; Min Operating Temperature: -30°C; Max Operating Temperature: 100°C; Packaging: Tape and Reel; ComponentLink1URL: https://datasheet.ciiva.com/29301/183266-da-01-en-optokoppler-sfh-615a-4xsmt-r-29301200.pdf?src-supplier=Conrad; ComponentLink1Description: https://datasheet.ciiva.com/29301/183266-da-01-en-optokoppler-sfh-615a-4xsmt-r-29301200.pdf?src-supplier=Conrad
U3 = SHUNTREG_TL431AQDBZR: 2.495V~36V -40℃~+125℃@(TA) 700uA 100mA Adjustable SOT-23(SOT-23-3)  Voltage References ROHS; Part_Number: TL431AQDBZR; JLC#: C105255; Package: SOT-23
U4 = PWMDRIVER_UC3842AD8TR: SOIC-8_150mil  AC-DC Controllers & Regulators ROHS; JLC#: C182337; Package: SOIC-8; Part_Number: UC3842AD8TR